# Altium schematic sheet sd_card.SchDoc
size A; SheetNumber: 5; SheetTotal: 9
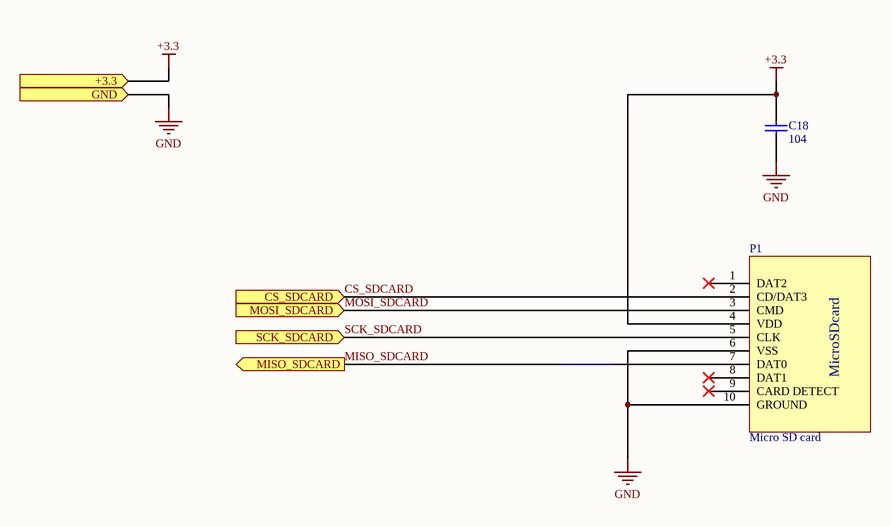
[diagram p0: sd_card.SchDoc]

## Parts
C18  104  [tu 0603]
P1  Micro SD card  [MicroSD]

## Ports
+3.3 (in), CS_SDCARD (in), GND (in), MISO_SDCARD (out), MOSI_SDCARD (in), SCK_SDCARD (in)

## Nets
+3.3: C18.1 P1.4(VDD) ; port +3.3
GND: C18.2 P1.6(VSS) P1.10(GROUND) ; port GND
CS_SDCARD: P1.2(CD/DAT3) ; port CS_SDCARD
MISO_SDCARD: P1.7(DAT0) ; port MISO_SDCARD
MOSI_SDCARD: P1.3(CMD) ; port MOSI_SDCARD
SCK_SDCARD: P1.5(CLK) ; port SCK_SDCARD

Not connected (* = marked no-connect by the designer): P1 1(DAT2)* 8(DAT1)* 9(CARD_DETECT)*

## Notes on the sheet
- (in symbol Micro SD card) MicroSDcard

## Library data of the parts
C18 = Tu 0603 104 50V 10%: Dán; Don_Vi: Con; So_Chan: 2; Ten_Linh_Kien: Tụ 0603 104-100nF 10% 50V; Ma_Hang: MH004568; Chung_Loai: Dán; Kieu_Chan: *